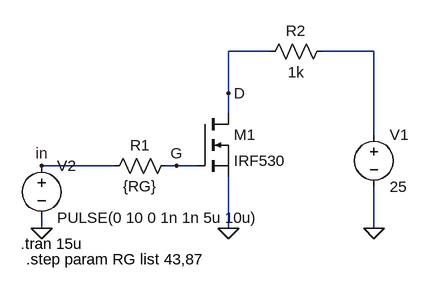
[diagram p0: schematic lab_03_Schalter_Einschaltzeit.asc]
lab_03_Schalter_Einschaltzeit.asc, the LTspice schematic file:
Version 4
SHEET 1 880 680
WIRE 304 -32 240 -32
WIRE 464 -32 384 -32
WIRE 240 32 240 -32
WIRE 240 64 240 32
WIRE 464 96 464 -32
WIRE 64 144 -48 144
WIRE 160 144 144 144
WIRE 192 144 160 144
WIRE -48 240 -48 224
WIRE 240 240 240 160
WIRE 464 240 464 176
FLAG 240 240 0
FLAG -48 240 0
FLAG 464 240 0
FLAG 160 144 G
FLAG 240 32 D
FLAG -48 144 in
SYMBOL nmos 192 64 R0
SYMATTR InstName M1
SYMATTR Value IRF530
SYMBOL res 160 128 R90
WINDOW 0 0 56 VBottom 2
WINDOW 3 32 56 VTop 2
SYMATTR InstName R1
SYMATTR Value {RG}
SYMBOL voltage 464 80 R0
SYMATTR InstName V1
SYMATTR Value 25
SYMBOL voltage -48 128 R0
WINDOW 123 0 0 Left 0
WINDOW 39 0 0 Left 0
SYMATTR InstName V2
SYMATTR Value PULSE(0 10 0 1n 1n 5u 10u)
SYMBOL res 400 -48 R90
WINDOW 0 0 56 VBottom 2
WINDOW 3 32 56 VTop 2
SYMATTR InstName R2
SYMATTR Value 1k
TEXT -80 264 Left 2 !.tran 15u
TEXT -72 288 Left 2 !.step param RG list 43,87

The netlist it stands for:
* lab_03_Schalter_Einschaltzeit.asc
M1 D G 0 0 IRF530
R1 G in {RG}
V1 N001 0 25
V2 in 0 PULSE(0 10 0 1n 1n 5u 10u)
R2 N001 D 1k
.model NMOS NMOS
.model PMOS PMOS
.lib standard.mos
.tran 15u
.step param RG list 43,87
.backanno
.end